# Altium schematic sheet singlefilter.SchDoc
size A4; SheetNumber: 3; SheetTotal: 10
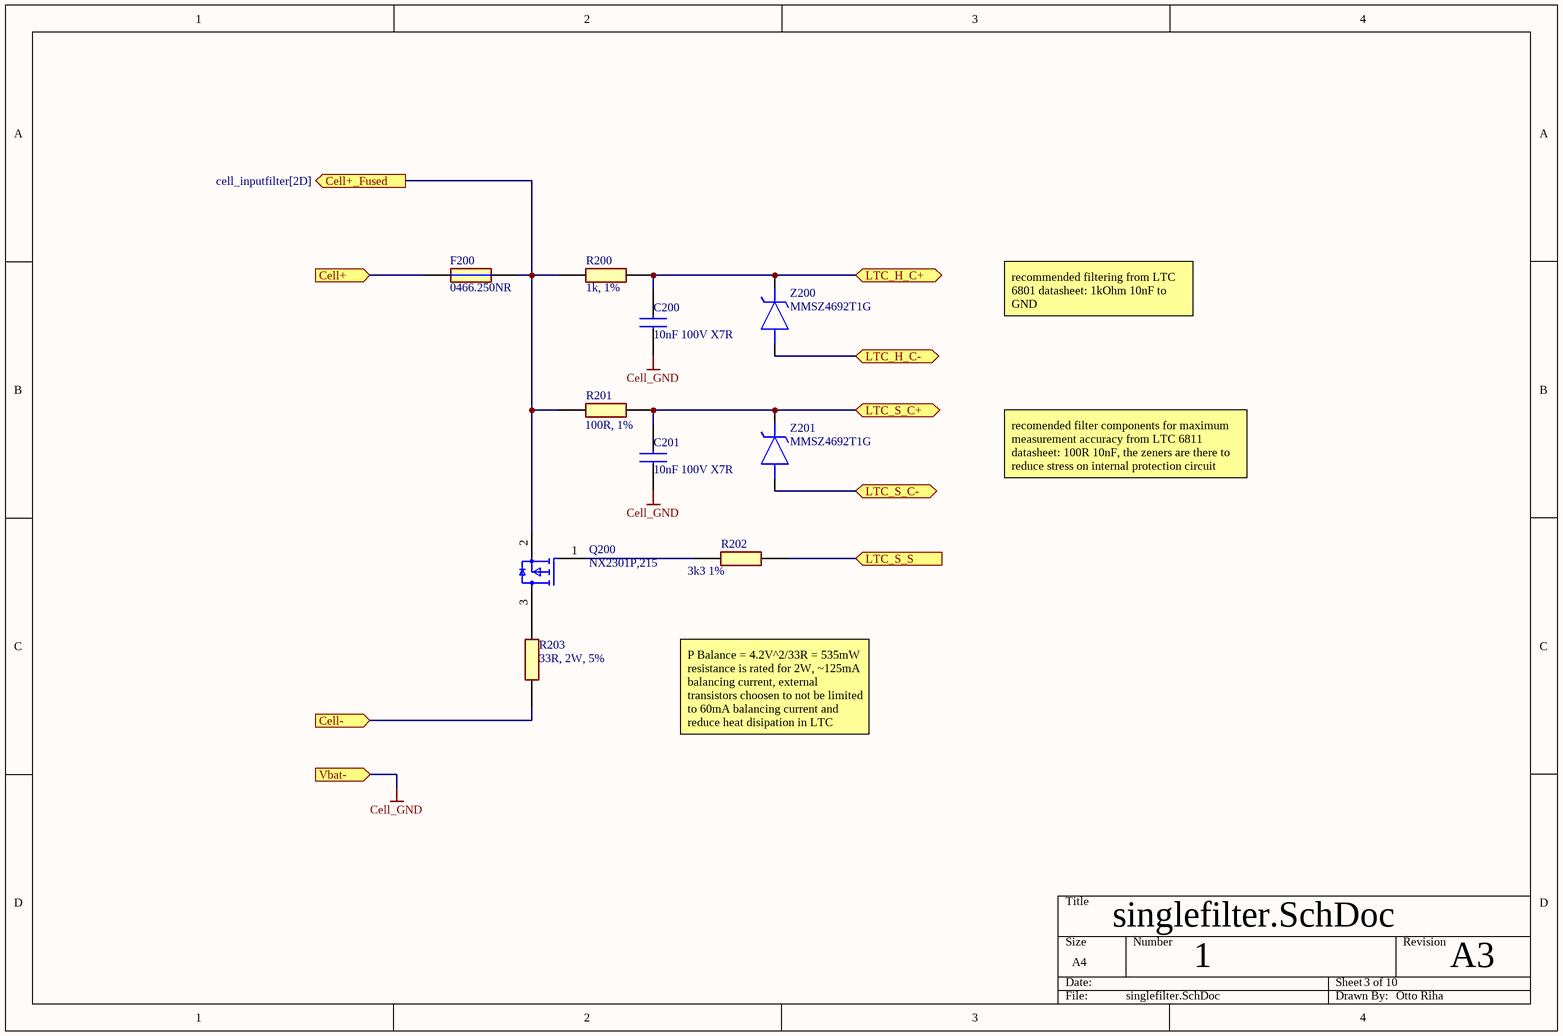
[diagram p0: singlefilter.SchDoc]

## Parts
C200  10nF 100V X7R  [CAPC1608X90N]
C201  10nF 100V X7R  [CAPC1608X90N]
F200  0466.250NR  [FUSC3215X66N]
Q200  NX2301P,215  [SOT95P230X110-3N]
R200  value 1k, 1%  [RESC1608X55N]  (hidden comment: AF0603FR-071KL)
R201  100R, 1%  [RESC1608X50N]
R202  3k3 1%  [RESC1608X55N]
R203  33R, 2W, 5%  [RESC6331X80N]
Z200  MMSZ4692T1G  [SOD3716X135N]
Z201  MMSZ4692T1G  [SOD3716X135N]

## Ports
Cell+ (in, see cell_inputfilter[2D]), Cell+_Fused (out, see cell_inputfilter[2D]), Cell- (in, see cell_inputfilter[2D]), LTC_H_C+ (bidir, see cell_inputfilter[2D]), LTC_H_C- (bidir, see cell_inputfilter[2D]), LTC_S_C+ (bidir, see cell_inputfilter[3D]), LTC_S_C- (bidir, see cell_inputfilter[2D]), LTC_S_S (in, see cell_inputfilter[3D]), Vbat- (in, see cell_inputfilter[2D])

## Nets
Cell_GND: C200.1 C201.1 ; port Vbat-
Cell+: F200.1 ; port Cell+
Cell+_Fused: F200.2 Q200.2(S) R200.1 R201.1 ; port Cell+_Fused
Cell-: R203.1 ; port Cell-
LTC_H_C+: C200.2 R200.2 Z200.1(K) ; port LTC_H_C+
LTC_H_C-: Z200.2(A) ; port LTC_H_C-
LTC_S_C+: C201.2 R201.2 Z201.1(K) ; port LTC_S_C+
LTC_S_C-: Z201.2(A) ; port LTC_S_C-
LTC_S_S: R202.2 ; port LTC_S_S
NetQ200_1: Q200.1(G) R202.1
NetQ200_3: Q200.3(D) R203.2

## Notes on the sheet
- recommended filtering from LTC 6801 datasheet: 1kOhm 10nF to GND
- recomended filter components for maximum measurement accuracy from LTC 6811 datasheet: 100R 10nF, the zeners are there to reduce stress on internal protection circuit
- P Balance = 4.2V^2/33R = 535mW resistance is rated for 2W, ~125mA balancing current, external transistors choosen to not be limited to 60mA balancing current and reduce heat disipation in LTC
- 1
- A3
- Otto Riha

## Library data of the parts
C200 C201 = 06031C103K4Z2A: Capacitor 10nF 100V X7R; Manufacturer_Name: Kyocera AVX; Datasheet Link: https://componentsearchengine.com/Datasheets/1/06031A100FAT2A.pdf; Height: 0.9mm; Manufacturer_Part_Number: 06031C103K4Z2A; Mouser Part Number: 581-06031C103K4Z2A; Mouser Price/Stock: https://www.mouser.com/Search/Refine.aspx?Keyword=581-06031C103K4Z2A; Arrow Part Number: 06031C103K4Z2A; Arrow Price/Stock: https://www.arrow.com/en/products/06031c103k4z2a/avx; Value: 10nF
F200 = 0466.250NR: Fuse; Manufacturer_Name: LITTELFUSE; Datasheet Link: http://www.littelfuse.com/~/media/electronics/datasheets/fuses/littelfuse_fuse_466_datasheet.pdf.pdf; Height: 0.66mm; Manufacturer_Part_Number: 0466.250NR; Mouser Part Number: 576-0466.250NR; Mouser Price/Stock: https://www.mouser.co.uk/ProductDetail/Littelfuse/0466.250NR?qs=OJFHm2hVE4FeDcEECJ4GEQ%3D%3D; Arrow Part Number: 0466.250NR; Arrow Price/Stock: https://www.arrow.com/en/products/0466.250nr/littelfuse?region=nac
Q200 = NX2301P,215: Integrated Circuit; Manufacturer_Name: Nexperia; Datasheet Link: https://assets.nexperia.com/documents/data-sheet/NX2301P.pdf; Height: 1.1mm; Manufacturer_Part_Number: NX2301P,215; Mouser Part Number: 771-NX2301P215; Mouser Price/Stock: https://www.mouser.co.uk/ProductDetail/Nexperia/NX2301P215?qs=A1cBxND5mHKs%252BLrxCDENxw%3D%3D; Arrow Part Number: NX2301P,215; Arrow Price/Stock: https://www.arrow.com/en/products/nx2301p215/nexperia?utm_currency=USD&region=europe
R200 = AF0603FR-071KL: Resistor 1k, 1%; Manufacturer_Name: YAGEO; Datasheet Link: https://www.mouser.de/datasheet/2/447/PYu_AF_51_RoHS_L_9-3358811.pdf; Height: 0.55mm; Manufacturer_Part_Number: AF0603FR-071KL; Mouser Part Number: 603-AF0603FR-071KL; Mouser Price/Stock: https://www.mouser.co.uk/ProductDetail/YAGEO/AF0603FR-071KL?qs=tggtontpCXPK7%252BIEiEzGxw%3D%3D; Supplier 1: Avnet; Supplier Part Number 1: AF0603FR-071KL
R201 = CRCW0603100RFKEA: Resistor 100R, 1%; Manufacturer_Name: Vishay; Datasheet Link: http://www.vishay.com/docs/20035/dcrcwe3.pdf; Height: 0.5mm; Manufacturer_Part_Number: CRCW0603100RFKEA; Mouser Part Number: 71-CRCW0603-100-E3; Mouser Price/Stock: https://www.mouser.co.uk/ProductDetail/Vishay-Dale/CRCW0603100RFKEA?qs=90AHS1y%2FsidGWjjxZAupKg%3D%3D; Arrow Part Number: CRCW0603100RFKEA; Arrow Price/Stock: https://www.arrow.com/en/products/crcw0603100rfkea/vishay?utm_currency=USD&region=europe; Supplier 1: Mouser; Supplier Part Number 1: 71-CRCW0603-100-E3; Value: 100R
R202 = CRGH0603F3K3: Resistor 3k3 1%; Manufacturer_Name: TE Connectivity; Datasheet Link: http://docs-europe.electrocomponents.com/webdocs/12d7/0900766b812d7379.pdf; Height: 0.55mm; Manufacturer_Part_Number: CRGH0603F3K3; Mouser Part Number: 279-CRGH0603F3K3; Value: 3k3; Supplier 1: Avnet; Supplier Part Number 1: 46AK9312
R203 = CRM2512-JW-330ELF: Resistor 33R, 2W, 5%; Manufacturer_Name: Bourns; Datasheet Link: http://www.bourns.com/data/global/pdfs/CRM0805_1206_2010.pdf; Height: 0.8mm; Manufacturer_Part_Number: CRM2512-JW-330ELF; Mouser Part Number: 652-CRM2512JW330ELF; Mouser Price/Stock: https://www.mouser.co.uk/ProductDetail/Bourns/CRM2512-JW-330ELF?qs=dxeCVZFKEXcR8BXxHz0dQA%3D%3D; Supplier 1: Mouser; Supplier Part Number 1: 652-CRM2512JW330ELF
Z200 Z201 = MMSZ4692T1G: Zener Diode 6.8V; Manufacturer_Name: onsemi; Datasheet Link: https://www.onsemi.com/pub/Collateral/MMSZ4678T1-D.PDF; Height: 1.35mm; Manufacturer_Part_Number: MMSZ4692T1G; Mouser Part Number: 863-MMSZ4692T1G; Mouser Price/Stock: https://www.mouser.co.uk/ProductDetail/onsemi/MMSZ4692T1G?qs=P4IOph%252Bbot8jSn3zyyx1xw%3D%3D; Arrow Part Number: MMSZ4692T1G; Arrow Price/Stock: https://www.arrow.com/en/products/mmsz4692t1g/on-semiconductor